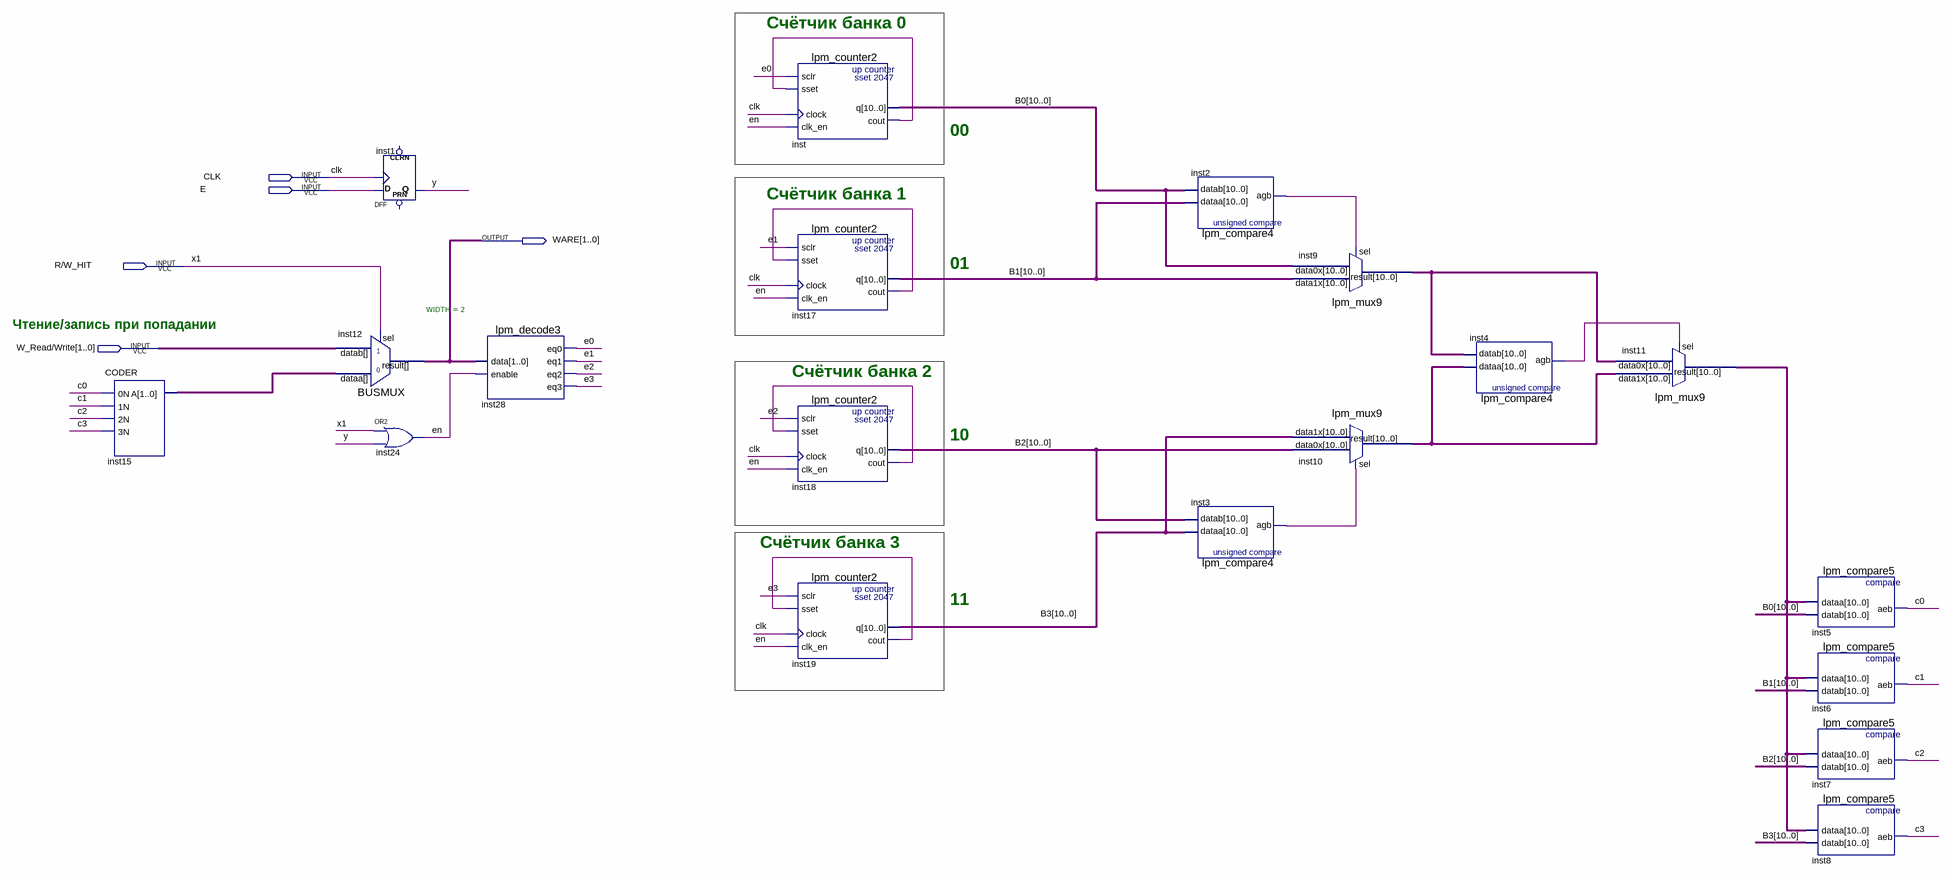
[diagram p0: schematic sheet]
// Quartus schematic Set_lru.bdf as structural Verilog: 19 symbols, 5 pins
module Set_lru (
  input  CLK,
  input  E,
  input  \R/W_HIT ,
  input  [1:0] \W_Read/Write ,
  output [1:0] WARE
);

  wire c0, c1, c2, c3, e0, e1, e2, e3, en, inst2_agb, inst3_agb, inst4_agb, inst17_cout, inst18_cout,
       inst19_cout, inst_cout, y;
  wire [1:0] inst15_a;
  wire [10:0] B0, B1, B2, B3, inst9_result, inst10_result, inst11_result;

  CODER inst15 (.\0N (c0), .\1N (c1), .\2N (c2), .\3N (c3), .A(inst15_a));
  DFF inst1 (.CLK(CLK), .D(E), .Q(y));  // open: CLRN, PRN
  BUSMUX #(.WIDTH(2)) inst12 (.datab(\W_Read/Write ), .sel(\R/W_HIT ), .dataa(inst15_a), .result(WARE));
  or inst24 (en, \R/W_HIT , y);
  lpm_decode3 inst28 (.data(WARE), .enable(en), .eq0(e0), .eq1(e1), .eq2(e2), .eq3(e3));
  lpm_counter2 inst (.sclr(e0), .sset(inst_cout), .clock(CLK), .clk_en(en), .q(B0), .cout(inst_cout));
  lpm_counter2 inst17 (.sclr(e1), .sset(inst17_cout), .clock(CLK), .clk_en(en), .q(B1), .cout(inst17_cout));
  lpm_counter2 inst18 (.sclr(e2), .sset(inst18_cout), .clock(CLK), .clk_en(en), .q(B2), .cout(inst18_cout));
  lpm_counter2 inst19 (.sclr(e3), .sset(inst19_cout), .clock(CLK), .clk_en(en), .q(B3), .cout(inst19_cout));
  lpm_compare4 inst2 (.dataa(B1), .datab(B0), .agb(inst2_agb));
  lpm_compare4 inst3 (.dataa(B3), .datab(B2), .agb(inst3_agb));
  lpm_mux9 inst9 (.data1x(B1), .data0x(B0), .sel(inst2_agb), .result(inst9_result));
  lpm_mux9 inst10 (.data1x(B3), .data0x(B2), .sel(inst3_agb), .result(inst10_result));
  lpm_compare4 inst4 (.dataa(inst10_result), .datab(inst9_result), .agb(inst4_agb));
  lpm_mux9 inst11 (.data1x(inst10_result), .data0x(inst9_result), .sel(inst4_agb), .result(inst11_result));
  lpm_compare5 inst5 (.dataa(inst11_result), .datab(B0), .aeb(c0));
  lpm_compare5 inst6 (.dataa(inst11_result), .datab(B1), .aeb(c1));
  lpm_compare5 inst7 (.dataa(inst11_result), .datab(B2), .aeb(c2));
  lpm_compare5 inst8 (.dataa(inst11_result), .datab(B3), .aeb(c3));

  // Other names for the same wires on the sheet: x1 = \R/W_HIT 

  // Notes on the sheet:
  //   Счётчик банка 0
  //   00
  //   Счётчик банка 1
  //   01
  //   Чтение/запись при попадании
  //   Счётчик банка 2
  //   10
  //   Счётчик банка 3
  //   11
endmodule
